# EAGLE design L298 motor controller (EAGLE 9.2.2)
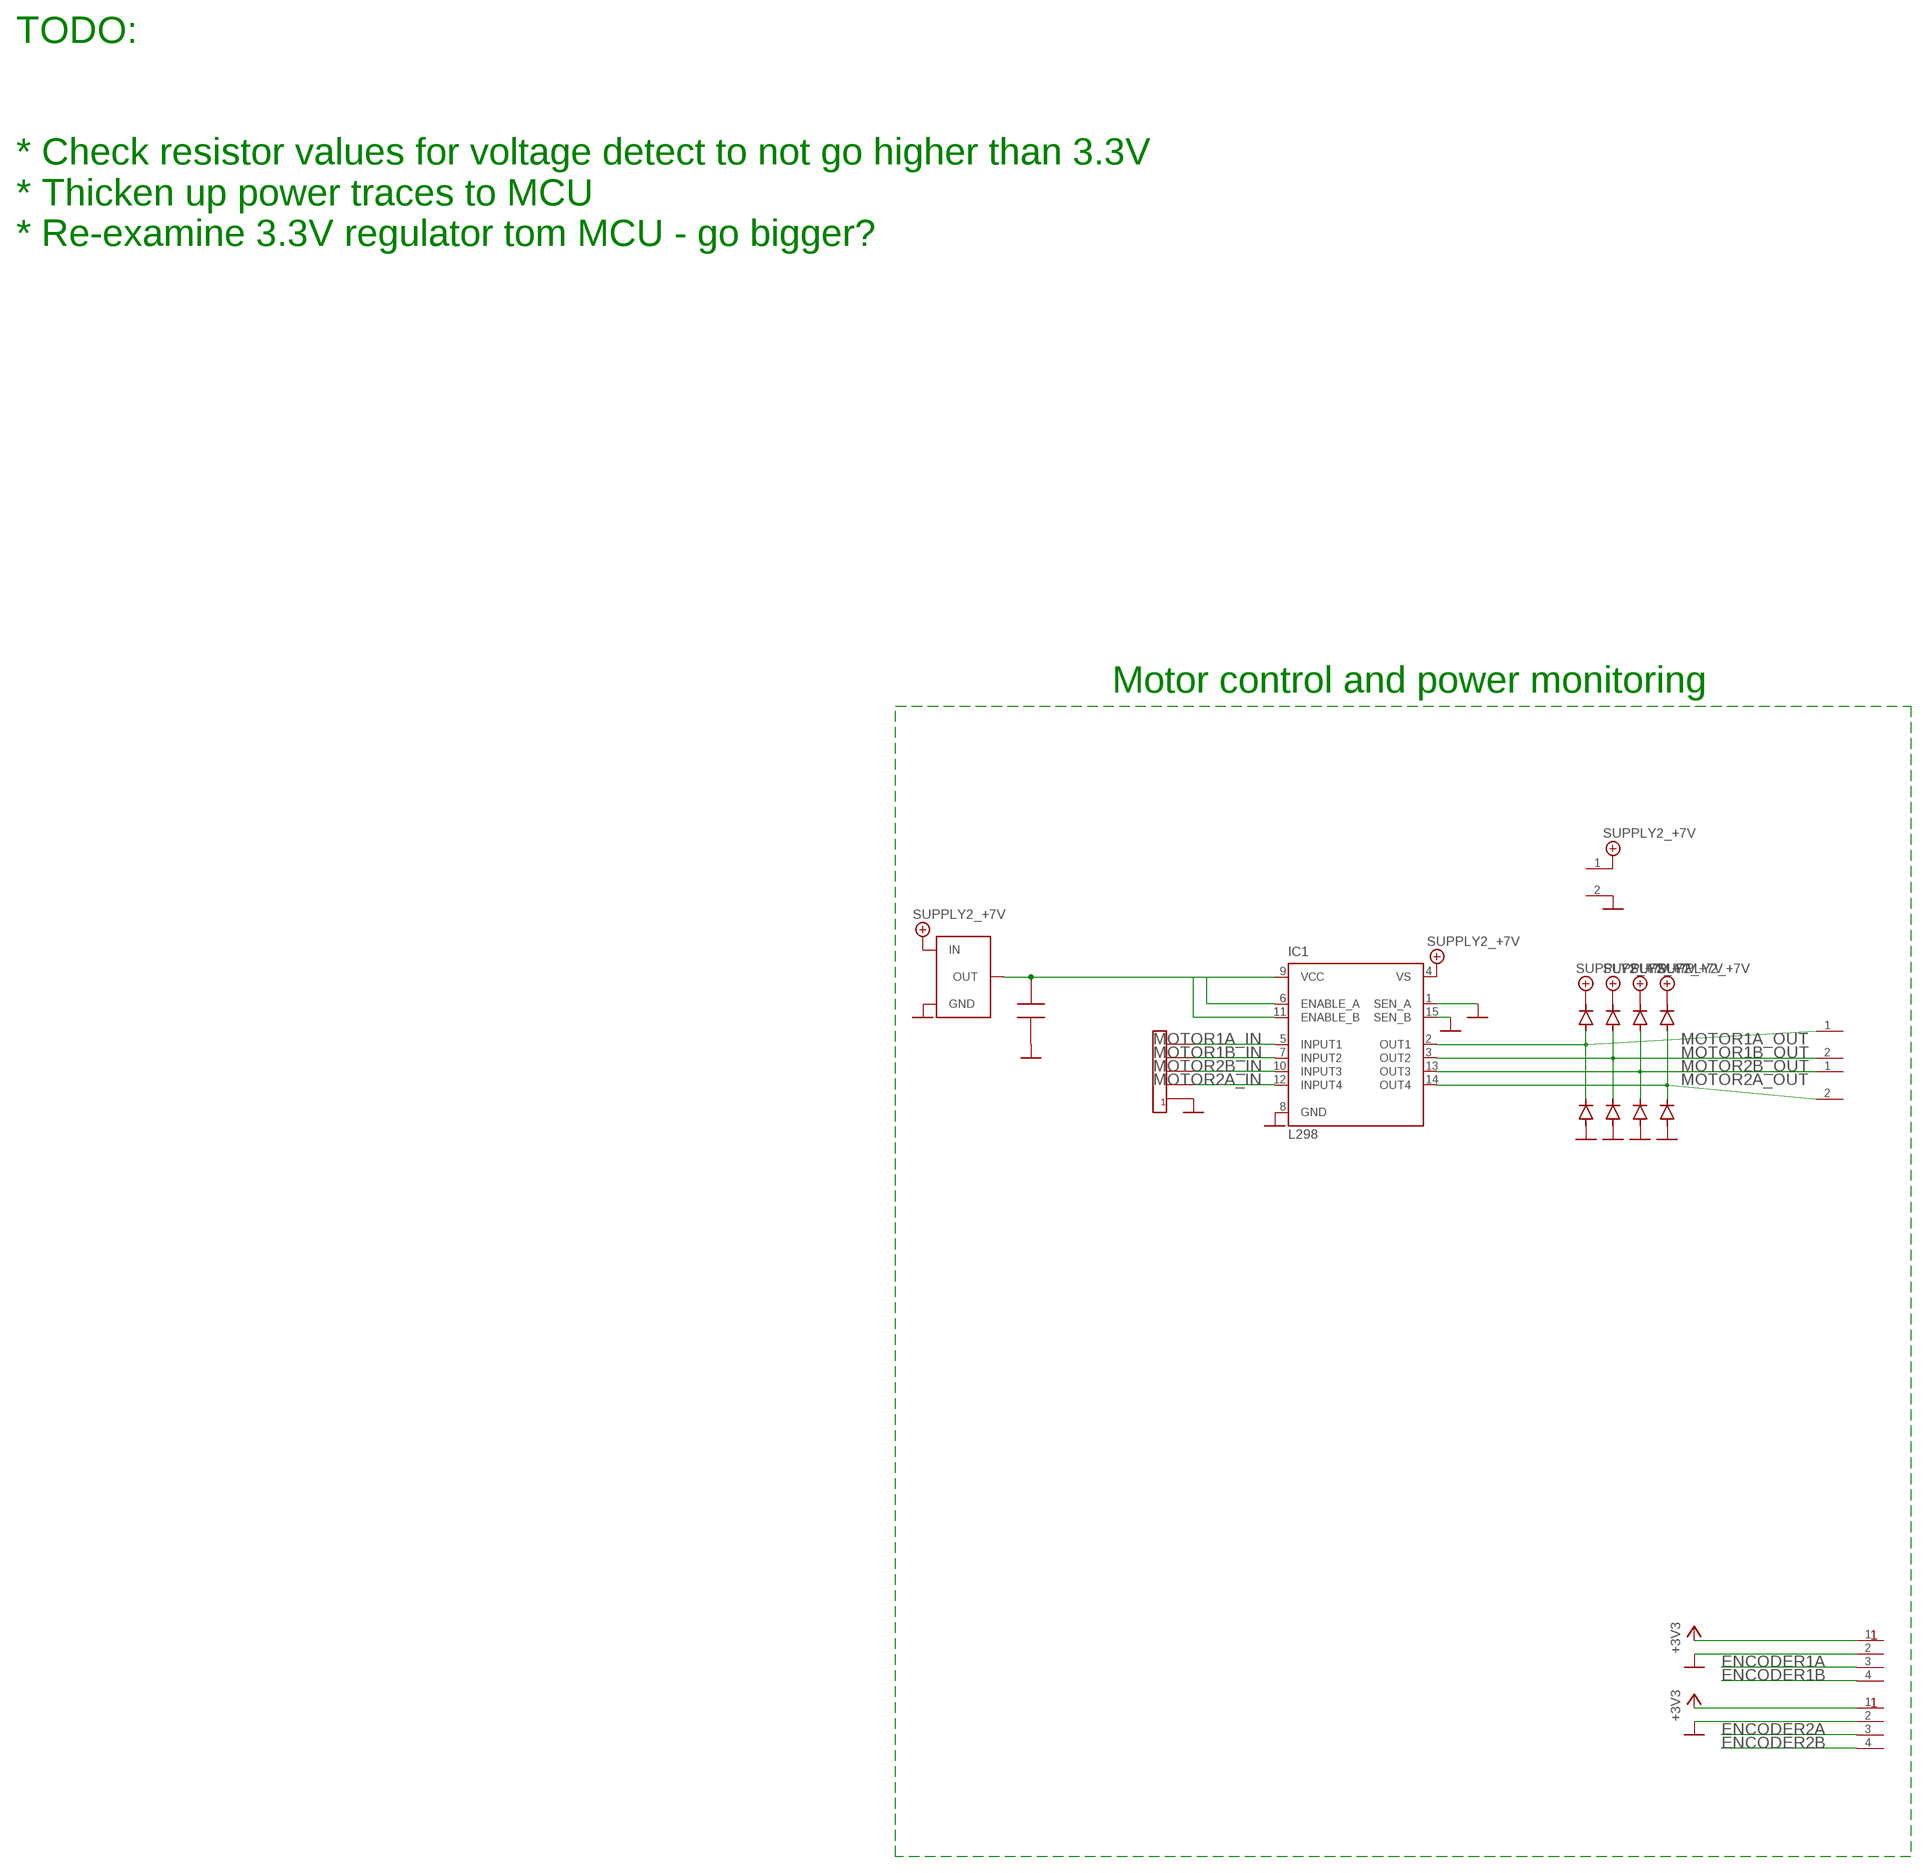
[diagram p0: schematic, sheet 1]

## Parts
IC1  L298  [MULTIWATT-15]
U$1  SCREW_TERMINAL_2_CONDUCTOR_M20109-ND  [WM20109-ND]
U$2  SCREW_TERMINAL_2_CONDUCTOR_M20109-ND  [WM20109-ND]
U$3  CONNECTOR_5_PIN  [JST_5_PIN_PH_SERIES]
U$4  SCREW_TERMINAL_2_CONDUCTOR_M20109-ND  [WM20109-ND]
U$13  DIODESOD-123FL  [SOD-123FL]
U$14  DIODESOD-123FL  [SOD-123FL]
U$16  DIODESOD-123FL  [SOD-123FL]
U$18  DIODESOD-123FL  [SOD-123FL]
U$19  DIODESOD-123FL  [SOD-123FL]
U$20  DIODESOD-123FL  [SOD-123FL]
U$21  DIODESOD-123FL  [SOD-123FL]
U$22  DIODESOD-123FL  [SOD-123FL]
U$25  VOLTAGE_REGULATOR_3_TERMINALMCP1799_SOT23  [SOT23]
U$26  CAPACITOR0805  [0805]
U$46  CONNECTOR_4_PINJST_PH_SERIES  [JST_4_PIN_PH_SERIES]
U$49  CONNECTOR_4_PINJST_PH_SERIES  [JST_4_PIN_PH_SERIES]

## Nets
+3V3: U$46.1 U$49.1
+7V: IC1.4(VS) U$13.C U$14.C U$16.C U$18.C U$25.3(IN) ; supply symbol labelled SUPPLY2_+7V
ENCODER1A: U$46.3
ENCODER1B: U$46.4
ENCODER2A: U$49.3
ENCODER2B: U$49.4
GND: IC1.1(SEN_A) IC1.8(GND) IC1.15(SEN_B) U$3.1 U$19.A U$20.A U$21.A U$22.A U$25.1(GND) U$26.P$2(1+) U$46.2 U$49.2 ; supply symbol labelled SUPPLY1_GND
MOTOR1A_IN: IC1.5(INPUT1) U$3.5
MOTOR1A_OUT: IC1.2(OUT1) U$1.1 U$13.A U$19.C
MOTOR1B_IN: IC1.7(INPUT2) U$3.4
MOTOR1B_OUT: IC1.3(OUT2) U$1.2 U$14.A U$20.C
MOTOR2A_IN: IC1.12(INPUT4) U$3.2
MOTOR2A_OUT: IC1.14(OUT4) U$2.2 U$18.A U$22.C
MOTOR2B_IN: IC1.10(INPUT3) U$3.3
MOTOR2B_OUT: IC1.13(OUT3) U$2.1 U$16.A U$21.C
N$13: IC1.6(ENABLE_A) IC1.9(VCC) IC1.11(ENABLE_B) U$25.2(OUT) U$26.P$3(2-)
Unconnected: U$4.1 U$4.2

## Notes on the sheet
- TODO:
  
  
  * Check resistor values for voltage detect to not go higher than 3.3V
  * Thicken up power traces to MCU
  * Re-examine 3.3V regulator tom MCU - go bigger?
- Motor control and power monitoring

## Library data of the parts
IC1 = st-microelectronics:L298: DUAL FULL-BRIDGE DRIVER; MPN: L298N; OC_FARNELL: 1589425; OC_NEWARK: 32M1527
U$1 U$2 U$4 = Jack:SCREW_TERMINAL_2_CONDUCTOR_M20109-ND
U$3 = Jack:CONNECTOR_5_PIN
U$13 U$14 U$16 U$18-U$22 = Jack:DIODE
U$25 = Jack:VOLTAGE_REGULATOR_3_TERMINAL
U$26 = Jack:CAPACITOR
U$46 U$49 = Jack:CONNECTOR_4_PIN

## Net classes
0 default: clearance 0.254 mm

## Board
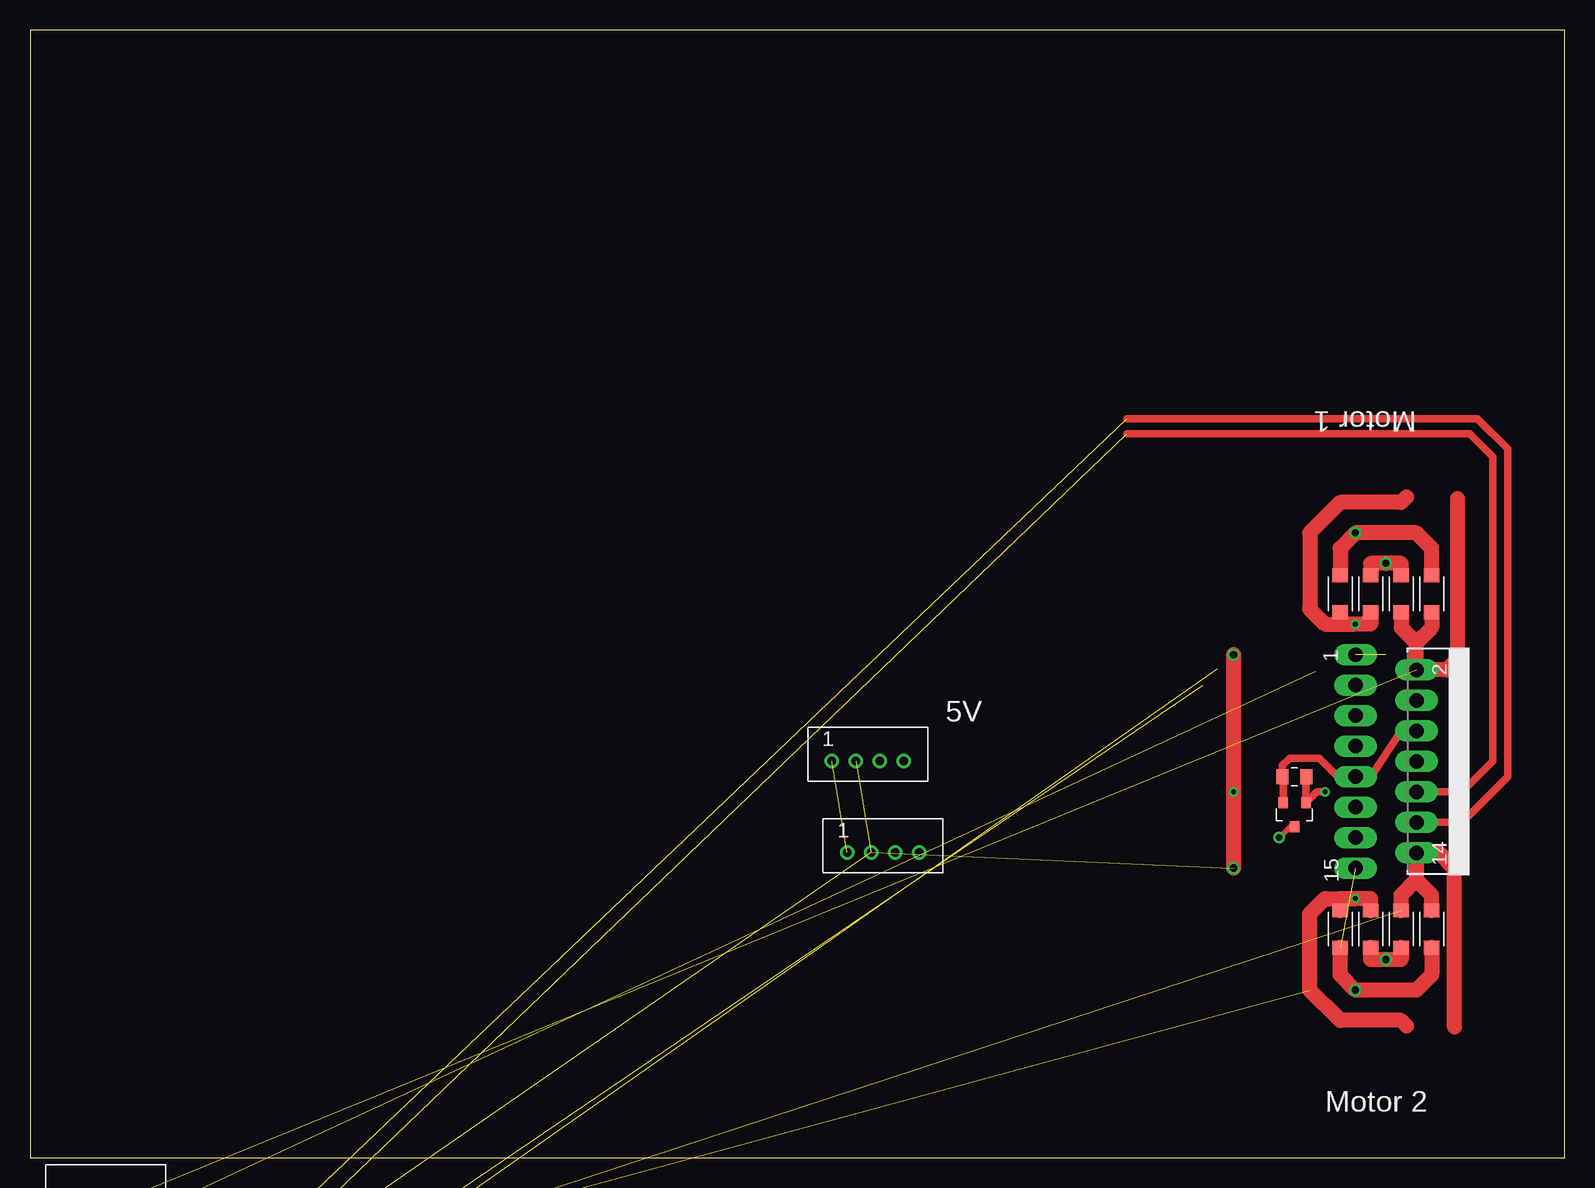
[diagram p1: board, top side]
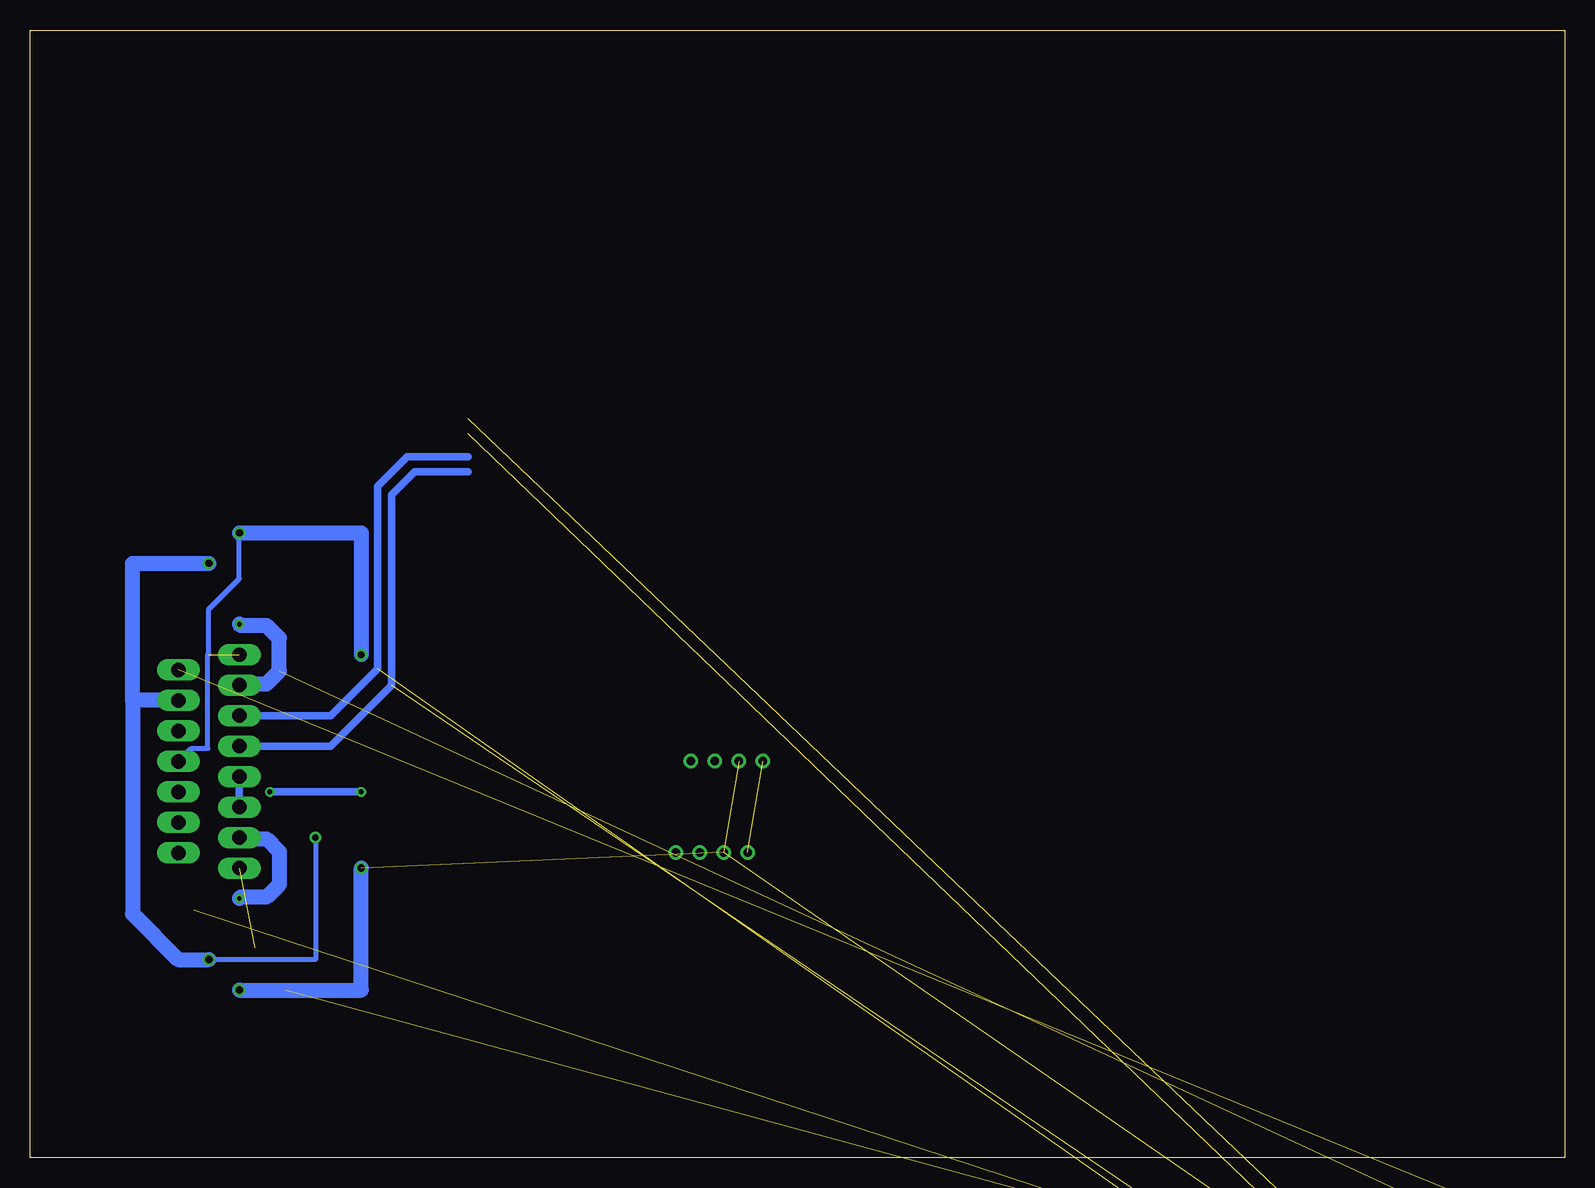
[diagram p2: board, bottom side, seen from below]

Size 127.94 x 93.97 mm. Coordinates in mm from the lower left corner, seen from the top.
Outline: 0,0 127.94,0 127.94,93.97 0,93.97 0,0
Copper layers (1*16): Top 0.035mm / dielectric 1.5mm / Bottom 0.035mm
Design rules "default *": minimum track width 6mil, minimum drill 0.4mm, track to track 6mil, track to pad 6mil, pad to pad 6mil, via to via 6mil, smd to smd 6mil, copper to edge 40mil, drill to drill 6mil, minimum pad ring 10mil, minimum via ring 8mil, stop-mask expansion 4mil, vias tented up to drill 0mil, thermal gap 10mil

### Footprints (pad centres in the part's own frame; a part is rotated, then mirrored left to right if it is on the bottom)
MULTIWATT-15 = drill 1.2 long: 1 -8.89,-7.62; 2 -7.62,-2.54; 3 -6.35,-7.62; 4 -5.08,-2.54; 5 -3.81,-7.62; 6 -2.54,-2.54; 7 -1.27,-7.62; 8 0,-2.54; 9 1.27,-7.62; 10 2.54,-2.54; 11 3.81,-7.62; 12 5.08,-2.54; 13 6.35,-7.62; 14 7.62,-2.54; 15 8.89,-7.62
WM20109-ND = drill 1.2: 1 0,0; 2 5,0
JST_5_PIN_PH_SERIES = drill 0.7: 1 -3,0.03; 2 -1,0.03; 3 1,0.03; 4 3,0.03; 5 5,0.03
SOD-123FL = smd 1.15 x 1.3: A -1.55,0; C 1.55,0
SOT23 = smd 0.8 x 0.9: 1 -0.95,-1; 2 0.95,-1; 3 0,1
0805 = smd 1 x 1.25: P$2 -1,0; P$3 1,0
JST_4_PIN_PH_SERIES = drill 0.7: 1 -3,0.03; 2 -1,0.03; 3 1,0.03; 4 3,0.03

### Placement (x,y rotation side)
IC1  118.11,33.02 270 top
U$1  3.81,-5.08 0 top  (outside the outline)
U$2  3.81,-13.97 0 top  (outside the outline)
U$3  5.08,-21.59 0 top  (outside the outline)
U$4  3.81,-27.94 0 top  (outside the outline)
U$13  114.3,46.99 90 top
U$14  111.76,46.99 90 top
U$16  111.76,19.05 270 top
U$18  114.3,19.05 270 top
U$19  116.84,46.99 270 top
U$20  109.22,46.99 270 top
U$21  109.22,19.05 90 top
U$22  116.84,19.05 90 top
U$25  105.41,28.57 180 top
U$26  105.41,31.75 180 top
U$46  69.85,33.02 0 top
U$49  71.12,25.4 0 top

### Tracks (layer width: path | path; a pad name or v marks a point on that pad's centre or on a via)
+3V3  (1 unrouted)
+7V  (via drill 0.55, 0.6)
  Top 0.406: v104.14,26.67 105.05,27.57 U$25.3
  Top 1.27: U$13.C 114.3,49.53 v113.03,49.53 111.76,49.53 U$14.C | U$18.C 114.3,16.51 v113.03,16.51 111.76,16.51 U$16.C
  Bottom 0.406: v113.03,16.51 104.14,16.51 v104.14,26.67
  Bottom 1.27: IC1.4 119.38,38.1 | 119.38,38.1 119.38,49.53 v113.03,49.53 | 119.38,38.1 119.38,20.32 115.57,16.51 v113.03,16.51
GND  (via drill 0.4, 0.6)  (5 unrouted)
  Top 0.61: U$26.P$2 106.36,31.7 U$25.1 107.27,30.48 v107.95,30.48
  Top 1.27: U$19.A 116.84,50.8 115.57,52.07 v110.49,52.07 109.22,50.8 U$20.A | U$22.A 116.84,15.24 115.57,13.97 v110.49,13.97 109.22,15.24 U$21.A | v100.33,41.91 v100.33,30.48 v100.33,24.13
  Bottom 0.406: IC1.8 114.49,34.1 113.11,34.1 113.11,41.91 113.03,41.91 113.03,45.72 110.49,48.26 v110.49,52.07 110.76,52.34 | 110.76,13.7 v110.49,13.97
  Bottom 0.61: v107.95,30.48 v100.33,30.48
  Bottom 1.27: v110.49,52.07 100.33,52.07 v100.33,41.91 | v110.49,13.97 100.33,13.97 v100.33,24.13
MOTOR1A_IN  (1 unrouted)
  Bottom 0.61: IC1.5 102.87,36.83 98.97,40.73 98.97,55.97 96.52,58.42 91.44,58.42
MOTOR1A_OUT  (1 unrouted)
  Top 1.27: 115.57,42.9 116.84,44.17 U$19.C | 115.57,42.9 114.3,44.17 U$13.A | 115.57,42.9 IC1.2 118.11,40.64 118.99,41.52 118.99,54.92
MOTOR1B_IN  (1 unrouted)
  Bottom 0.61: IC1.7 102.87,34.29 97.79,39.37 97.79,55.24 95.89,57.15 91.44,57.15
MOTOR1B_OUT  (via drill 0.4)  (1 unrouted)
  Top 1.27: U$14.A 111.76,44.45 v110.49,44.45 | v110.49,44.45 109.22,44.45 U$20.C | 114.76,55.07 114.3,54.61 109.22,54.61 106.68,52.07 106.68,45.72 107.95,44.45 v110.49,44.45
  Bottom 1.27: IC1.3 110.37,39.49 108.21,39.49 107.17,40.53 107.17,43.29 108.21,44.33 110.37,44.33 v110.49,44.45
MOTOR2A_IN  (1 unrouted)
  Top 0.61: IC1.12 119.38,27.94 123.19,31.75 123.19,59.05 120.65,61.59 91.44,61.59
MOTOR2A_OUT  (1 unrouted)
  Top 1.27: U$22.C 116.84,21.87 115.57,23.14 | 115.57,22.86 115.57,23.14 | U$18.A 114.3,21.87 115.57,23.14 | 115.57,23.14 IC1.14 117.47,25.4 118.75,24.13 118.75,10.88
MOTOR2B_IN  (1 unrouted)
  Top 0.61: IC1.10 119.38,30.48 121.92,33.02 121.92,58.42 120.02,60.33 91.44,60.33
MOTOR2B_OUT  (via drill 0.4)  (1 unrouted)
  Top 1.27: U$16.A 111.76,21.59 v110.49,21.59 | v110.49,21.59 109.22,21.59 U$21.C | 114.76,10.97 114.3,11.43 109.22,11.43 106.68,13.97 106.68,20.32 107.95,21.59 v110.49,21.59
  Bottom 1.27: IC1.13 110.37,26.55 108.21,26.55 107.17,25.51 107.17,22.75 108.21,21.71 110.37,21.71 v110.49,21.59
N$13
  Top 0.61: IC1.6 114.3,35.56 111.76,31.75 IC1.9 109.11,31.75 109.07,31.71 107.49,33.29 105.01,33.29 104.41,32.69 U$26.P$3 104.46,31.7 U$25.2
  Bottom 0.61: IC1.11 IC1.9

### Text on the board
tPlace: Motor 1 | 5V | Motor 2